# EAGLE design motorsturing (EAGLE 9.6.2)
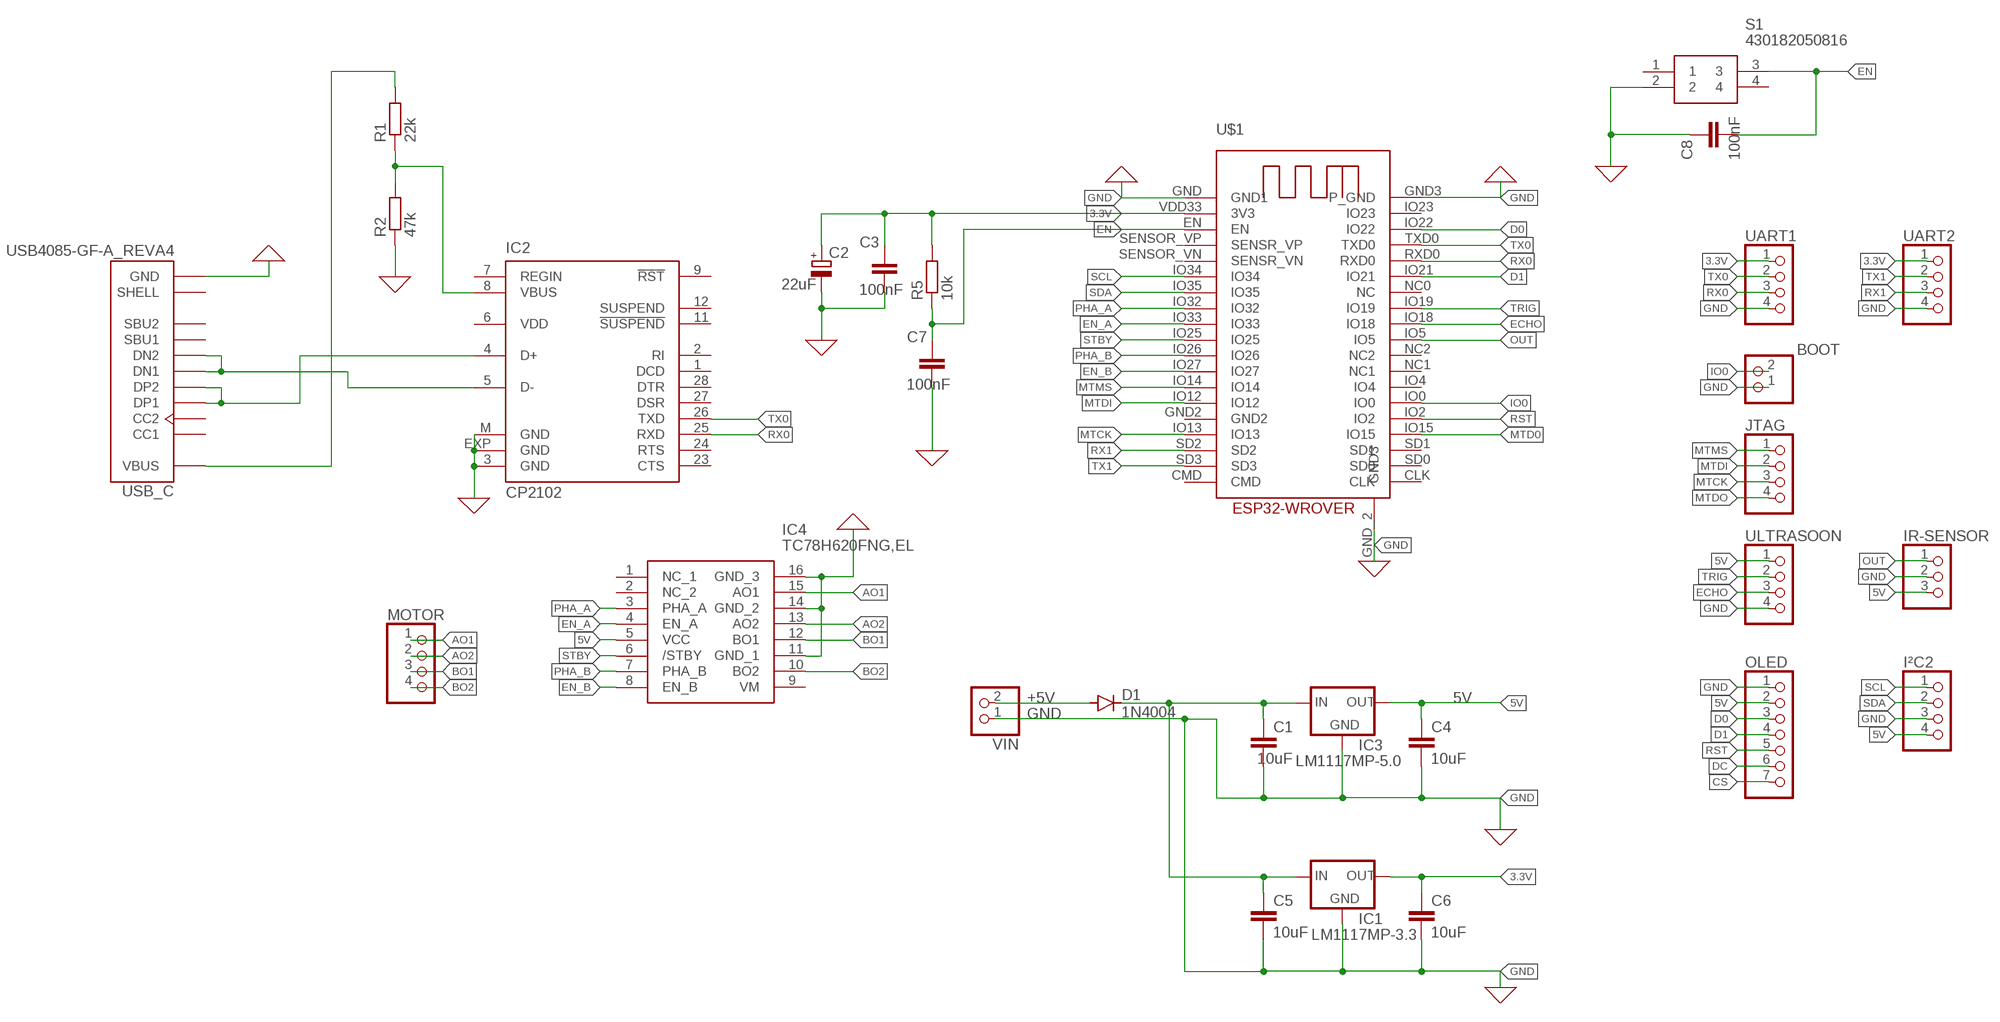
[diagram p0: schematic, sheet 1]

## Parts
BOOT  PINHD-1X2  [1X02]
C1  10uF  C-EUC0603  [C0603]
C2  22uF  CPOL-EUE5-4  [E5-4]
C3  100nF  C-EUC0805  [C0805]
C4  10uF  C-EUC0603  [C0603]
C5  10uF  C-EUC0603  [C0603]
C6  10uF  C-EUC0603  [C0603]
C7  100nF  C-EUC0805  [C0805]
C8  100nF  C-EUC0805  [C0805]
D1  1N4004  [DO41-10]
IC1  LM1117MP-3.3  [SOT223]
IC2  CP2102  [MLP28]
IC3  LM1117MP-5.0  [SOT223]
IC4  TC78H620FNG,EL  [SOP65P640X160-16N]
IR-SENSOR  PINHD-1X3  [1X03]
I²C2  PINHD-1X4  [1X04]
JTAG  PINHD-1X4  [1X04]
MOTOR  PINHD-1X4  [1X04]
OLED  PINHD-1X7  [1X07]
R1  22k  R-EU_M0805  [M0805]
R2  47k  R-EU_M0805  [M0805]
R5  10k  R-EU_M0805  [M0805]
S1  430182050816  [430182070816]
U$1  ESP32-WROVER  [ESP32-WROVER]
UART1  PINHD-1X4  [1X04]
UART2  PINHD-1X4  [1X04]
ULTRASOON  PINHD-1X4  [1X04]
USB_C  USB4085-GF-A_REVA4  [GCT_USB4085-GF-A_REVA4]
VIN  PINHD-1X2  [1X02]

## Nets
0: C2.- C3.1 C7.1 C8.2 IC2.3(GND) IC2.EXP(GND) IC2.M(GND) IC4.11(GND_1) IC4.14(GND_2) IC4.16(GND_3) R2.1 S1.2 USB_C.A1(GND) USB_C.A12(GND) USB_C.B1(GND) USB_C.B12(GND) ; supply symbol labelled GND
3.3V: C2.+ C3.2 C6.1 IC1.2(OUT) IC1.4(OUT) R5.2 U$1.VDD33(3V3) UART1.1 UART2.1
5V: C4.1 IC3.2(OUT) IC3.4(OUT) IC4.5(VCC) IR-SENSOR.3 I²C2.4 OLED.2 ULTRASOON.1
+5V: D1.A VIN.2
AO1: IC4.15(AO1) MOTOR.1
AO2: IC4.13(AO2) MOTOR.2
BO1: IC4.12(BO1) MOTOR.3
BO2: IC4.10(BO2) MOTOR.4
CS: OLED.7
D0: OLED.3 U$1.IO22
D1: OLED.4 U$1.IO21
DC: OLED.6
ECHO: U$1.IO18 ULTRASOON.3
EN: C7.2 C8.1 R5.1 S1.3 U$1.EN
EN_A: IC4.4(EN_A) U$1.IO33
EN_B: IC4.8(EN_B) U$1.IO27
GND: BOOT.1 C1.2 C4.2 C5.2 C6.2 IC1.1(GND) IC3.1(GND) IR-SENSOR.2 I²C2.3 OLED.1 U$1.GND3(P_GND) U$1.GND(GND1) U$1.GND_2(GND3) UART1.4 UART2.4 ULTRASOON.4 VIN.1
IO0: BOOT.2 U$1.IO0
MTCK: JTAG.3 U$1.IO13
MTD0: U$1.IO15
MTDI: JTAG.2 U$1.IO12
MTDO: JTAG.4
MTMS: JTAG.1 U$1.IO14
N$1: IC2.5(D-) USB_C.A7(DN1) USB_C.B7(DN2)
N$2: IC2.4(D+) USB_C.A6(DP1) USB_C.B6(DP2)
N$3: R1.2 USB_C.A4(VBUS) USB_C.A9(VBUS) USB_C.B4(VBUS) USB_C.B9(VBUS)
N$4: IC2.8(VBUS) R1.1 R2.2
N$41: C1.1 C5.1 D1.C IC1.3(IN) IC3.3(IN)
OUT: IR-SENSOR.1 U$1.IO5
PHA_A: IC4.3(PHA_A) U$1.IO32
PHA_B: IC4.7(PHA_B) U$1.IO26
RST: OLED.5 U$1.IO2
RX0: IC2.25(RXD) U$1.RXD0 UART1.3
RX1: U$1.SD2 UART2.3
SCL: I²C2.1 U$1.IO34
SDA: I²C2.2 U$1.IO35
STBY: IC4.6(/STBY) U$1.IO25
TRIG: U$1.IO19 ULTRASOON.2
TX0: IC2.26(TXD) U$1.TXD0 UART1.2
TX1: U$1.SD3 UART2.2
Unconnected: IC2.1(DCD) IC2.2(RI) IC2.7(REGIN) IC2.9(!RST) IC2.11(!SUSPEND) IC2.12(SUSPEND) IC2.23(CTS) IC2.24(RTS) IC2.27(DSR) IC2.28(DTR) IC4.1(NC_1) IC4.2(NC_2) IC4.9(VM) S1.1 S1.4 U$1.CLK U$1.CMD U$1.GND2 U$1.IO4 U$1.IO23 U$1.NC0(NC) U$1.NC1 U$1.NC2 U$1.SD0 U$1.SD1 U$1.SENSOR_VN(SENSR_VN) U$1.SENSOR_VP(SENSR_VP) USB_C.A5(CC1) USB_C.A8(SBU1) USB_C.B5(CC2) USB_C.B8(SBU2) USB_C.P1(SHELL) USB_C.P2(SHELL) USB_C.P3(SHELL) USB_C.P4(SHELL)

## Power pins joined to a net without a drawn wire
VDD: IC2.6(VDD)

## Library data of the parts
BOOT VIN = pinhead:PINHD-1X2: PIN HEADER
C1 C3-C8 = rcl:C-EU: CAPACITOR, European symbol; SPICEPREFIX: C
C2 = rcl:CPOL-EU: POLARIZED CAPACITOR, European symbol; SPICEPREFIX: C
D1 = diode:1N4004: DIODE general purpose rectifier, 1 A
IC1 = lm1117_11:LM1117?-*: 800mA Low-Dropout Linear Regulator Source: http://www.ti.com/lit/ds/symlink/lm1117-n.pdf; MF: Texas Instruments; MPN: LM1117MP-3.3; OC_FARNELL: 9778195; OC_NEWARK: 28X3416
IC2 = silabs:CP210*: Single-Chip USB to UART Bridge Source: www.silabs.com .. CP2101.pdf / cp2102.pdf; MF: FARNELL; MPN: CP2102-GM; OC_FARNELL: 9282130; OC_NEWARK: 30K5635
IC3 = lm1117_11:LM1117?-*: 800mA Low-Dropout Linear Regulator Source: http://www.ti.com/lit/ds/symlink/lm1117-n.pdf; MF: Texas Instruments; MPN: LM1117MP-5.0; OC_FARNELL: 9778209; OC_NEWARK: 28X3417
IC4 = TC78H621FNG:TC78H620FNG,EL: Motor / Motion / Ignition Controllers & Drivers Brush Motor Driver IC 18V 1A Source: Datasheet <https://www.mouser.com/datasheet/2/408/TC78H620FNG_datasheet_en_20161125-1138306.pdf>; ARROW_PART_NUMBER: TC78H620FNG,EL; ARROW_PRICE-STOCK: https://www.arrow.com/en/products/tc78h620fngel/toshiba?region=nac; DESCRIPTION: Motor / Motion / Ignition Controllers & Drivers Brush Motor Driver IC 18V 1A; HEIGHT: 1.6mm; MANUFACTURER_NAME: Toshiba; MANUFACTURER_PART_NUMBER: TC78H620FNG,EL; MOUSER_PART_NUMBER: 757-TC78H620FNGEL; MOUSER_PRICE-STOCK: https://www.mouser.co.uk/ProductDetail/Toshiba/TC78H620FNGEL?qs=gt1LBUVyoHkIiKQSc8wkDw%3D%3D
IR-SENSOR = pinhead:PINHD-1X3: PIN HEADER
I²C2 JTAG MOTOR UART1 UART2 ULTRASOON = pinhead:PINHD-1X4: PIN HEADER
OLED = pinhead:PINHD-1X7: PIN HEADER
R1 R2 R5 = rcl:R-EU_: RESISTOR, European symbol; SPICEPREFIX: R
S1 = push button:430182050816: Black Tactile Tactile Switch, NO 50 mA 1.6mm Surface Mount Source: Datasheet <http://katalog.we-online.de/em/datasheet/4301x2xxx8x6.pdf>; DESCRIPTION: Black Tactile Tactile Switch, NO 50 mA 1.6mm Surface Mount; HEIGHT: mm; MANUFACTURER_NAME: Wurth Elektronik; MANUFACTURER_PART_NUMBER: 430182050816; MOUSER_PART_NUMBER: 710-430182050816; MOUSER_PRICE-STOCK: https://www.mouser.co.uk/ProductDetail/Wurth-Elektronik/430182050816?qs=wr8lucFkNMUyle0jQPgWGw%3D%3D
U$1 = 32teeth - ESP32-WROVER:ESP32-WROVER
USB_C = USB4085-GF-A:USB4085-GF-A_REVA4: USB 2.0 Type C Receptacle Dip Type, PCB Top Mount Check availability <https://pricing.snapeda.com/parts/USB4085-GF-A/Global%20Connector%20Technology/view-part?ref=eda>; AVAILABILITY: In Stock; DESCRIPTION: USB-C (USB TYPE-C) USB 2.0 Receptacle Connector 24 (16+8 Dummy) Position Through Hole, Right Angle, low cost, 3.46mm profile, 16 pin, horizontal, Top mount; MF: Global Connector Technology; MP: USB4085-GF-A; PACKAGE: None; PRICE: None; PURCHASE-URL: https://pricing.snapeda.com/search/part/USB4085-GF-A/?ref=eda

## Board
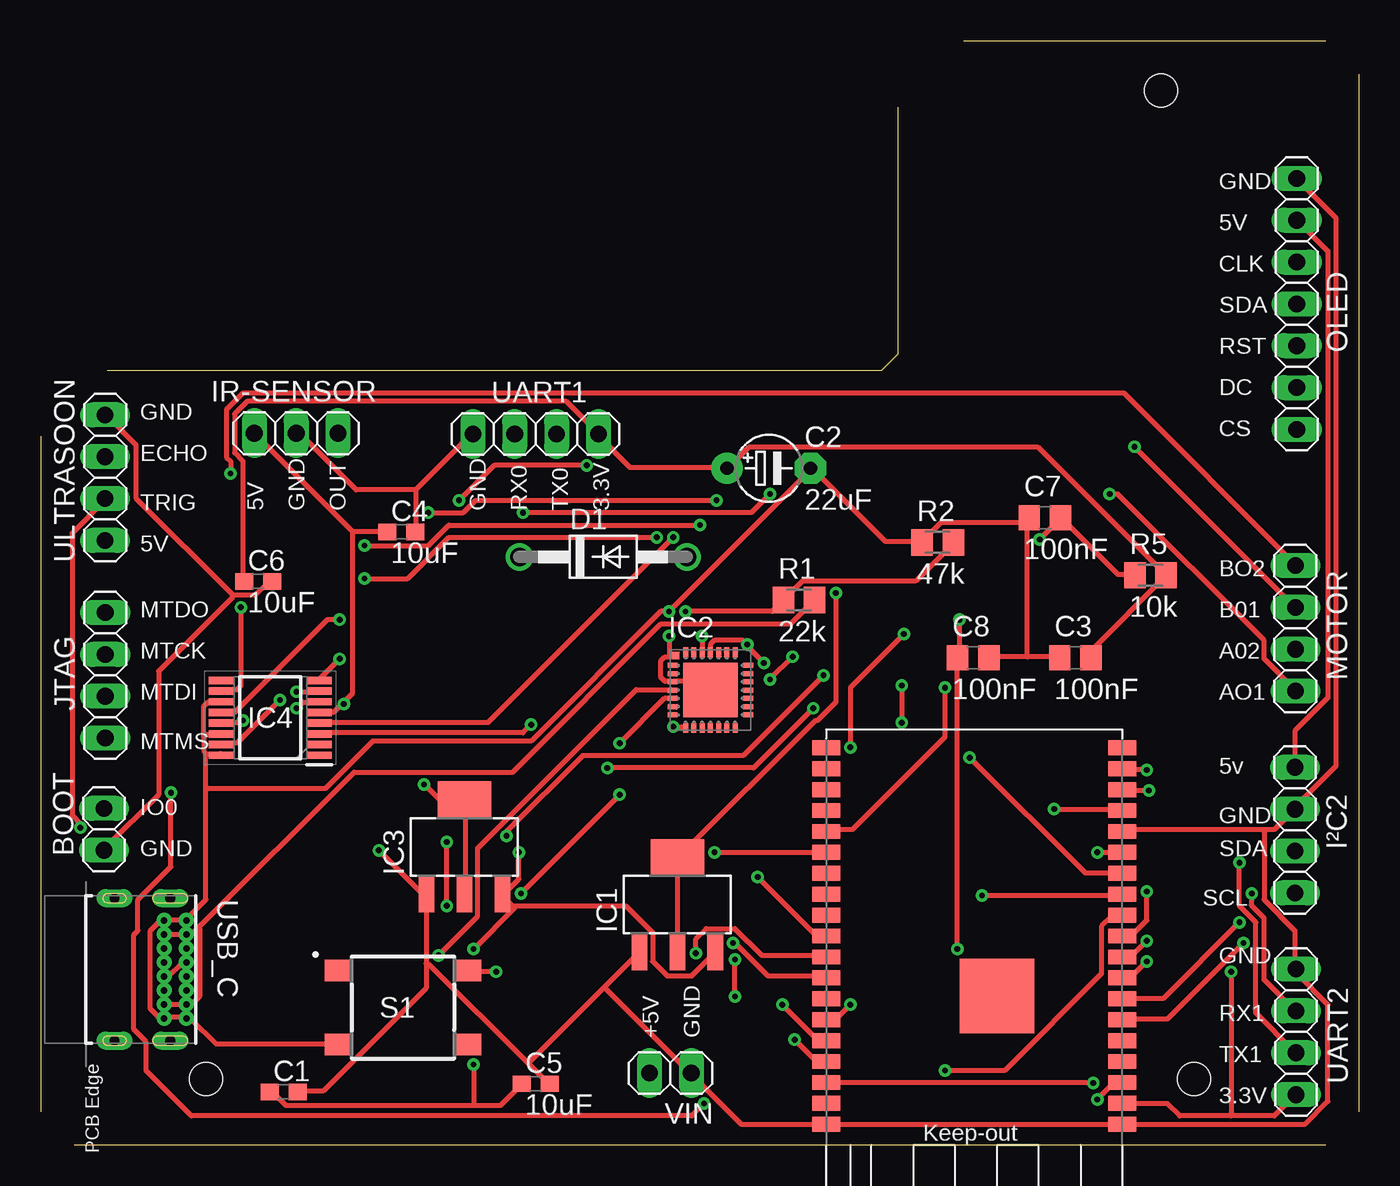
[diagram p1: board, top side]
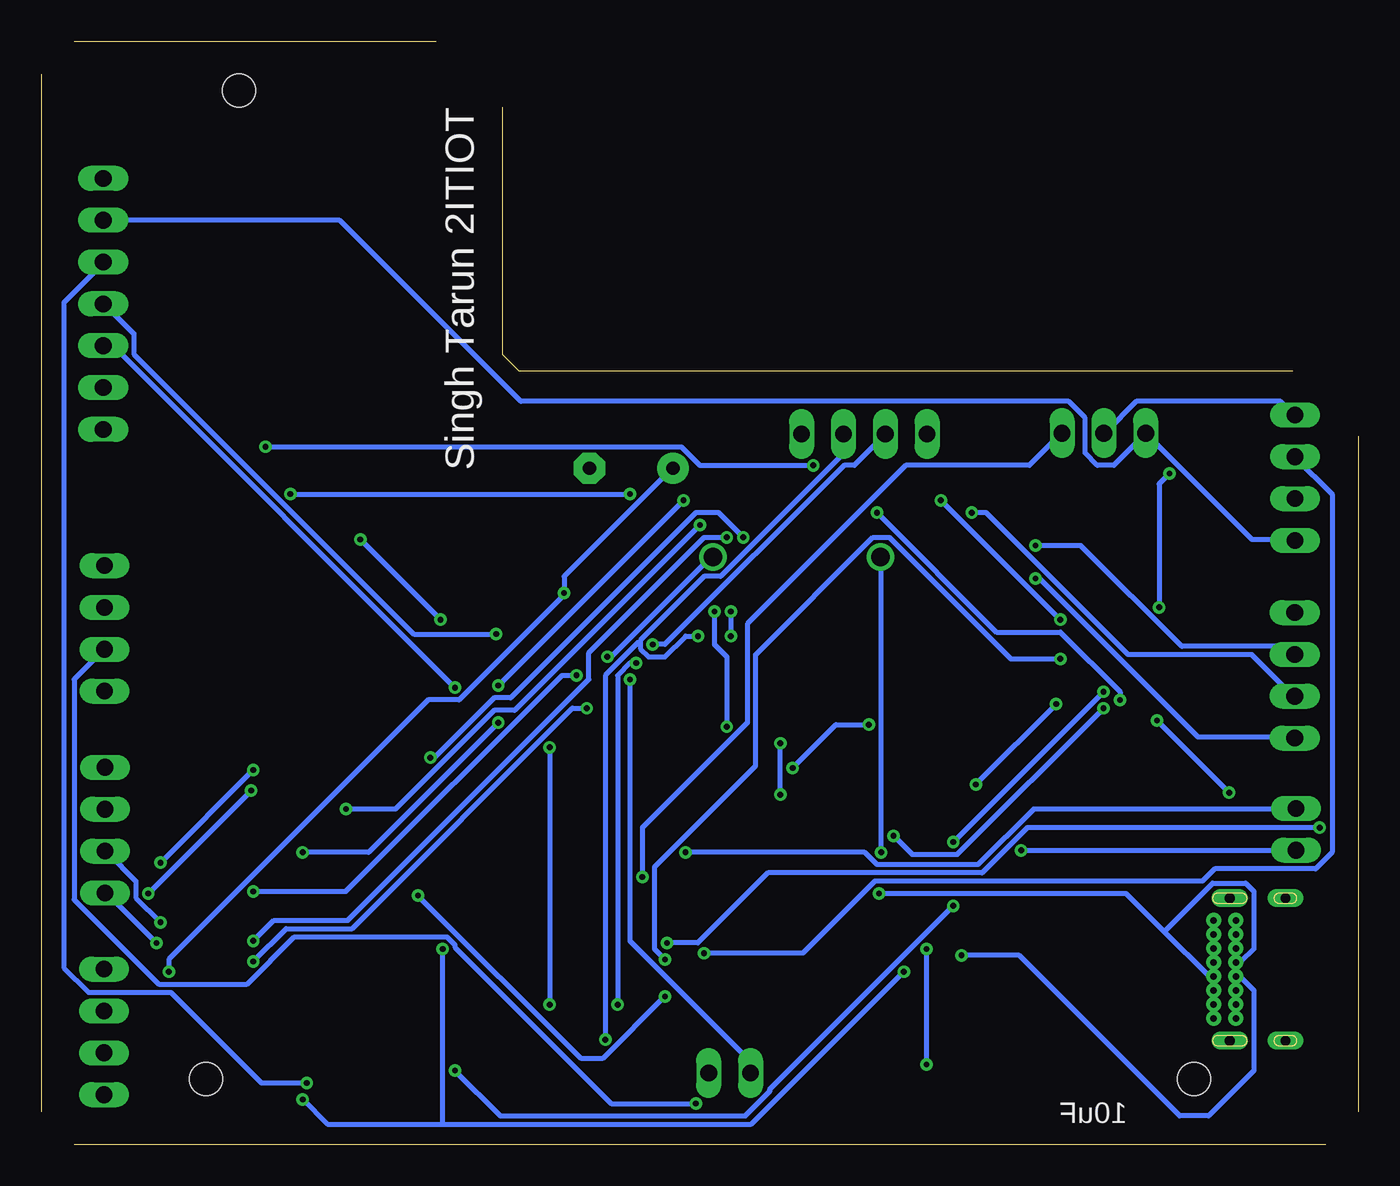
[diagram p2: board, bottom side, seen from below]

Size 80 x 67 mm. Coordinates in mm from the lower left corner, seen from the top.
Outline: 2,0 78,0
Outline: 80,65 80,2
Outline: 52,63 52,48 51,47 4,47
Outline: 78,67 56,67
Outline: 0,2 0,43
Copper layers (1*16): Top 0.035mm / dielectric 1.5mm / Bottom 0.035mm
Design rules "default *": minimum track width 12mil, minimum drill 0.35mm, track to track 6mil, track to pad 6mil, pad to pad 6mil, via to via 6mil, smd to smd 6mil, copper to edge 40mil, drill to drill 6mil, minimum pad ring 10mil, minimum via ring 8mil, stop-mask expansion 4mil, vias tented up to drill 0mil, thermal gap 10mil
Holes 2 mm at 10,4 70,4 68,64

### Footprints (pad centres in the part's own frame; a part is rotated, then mirrored left to right if it is on the bottom)
1X02 = drill 1.016 long: 1 -1.27,0; 2 1.27,0
C0603 = smd 1.1 x 1: 1 -0.85,0; 2 0.85,0
E5-4 = drill 0.813 pad 1.905: + -2.54,0 | drill 0.813 pad 1.905 octagon: - 2.54,0
C0805 = smd 1.3 x 1.5: 1 -0.95,0; 2 0.95,0
DO41-10 = drill 1.118: A 5.08,0; C -5.08,0
SOT223 = smd 0.95 x 2.15: 1 -2.3,-2.9; 2 0,-2.9; 3 2.3,-2.9 | smd 3.25 x 2.15: 4 0,2.9
MLP28 = smd 0.6 x 0.3: 1 -2.3,1.5; 2 -2.3,1; 3 -2.3,0.5; 4 -2.3,0; 5 -2.3,-0.5; 6 -2.3,-1; 7 -2.3,-1.5; 15 2.3,-1.5; 16 2.3,-1; 17 2.3,-0.5; 18 2.3,0; 19 2.3,0.5; 20 2.3,1; 21 2.3,1.5 | smd 0.3 x 0.6: 8 -1.5,-2.3; 9 -1,-2.3; 10 -0.5,-2.3; 11 0,-2.3; 12 0.5,-2.3; 13 1,-2.3; 14 1.5,-2.3; 22 1.5,2.3; 23 1,2.3; 24 0.5,2.3; 25 0,2.3; 26 -0.5,2.3; 27 -1,2.3; 28 -1.5,2.3 | smd 3.3 x 3.3: EXP 0,0 | smd 0.435 x 0.435: M -2.103,2.103
SOP65P640X160-16N = smd 1.525 x 0.45: 1 -2.962,2.275; 2 -2.962,1.625; 3 -2.962,0.975; 4 -2.962,0.325; 5 -2.962,-0.325; 6 -2.962,-0.975; 7 -2.962,-1.625; 8 -2.962,-2.275; 9 2.962,-2.275; 10 2.962,-1.625; 11 2.962,-0.975; 12 2.962,-0.325; 13 2.962,0.325; 14 2.962,0.975; 15 2.962,1.625; 16 2.962,2.275
1X03 = drill 1.016 long: 1 -2.54,0; 2 0,0; 3 2.54,0
1X04 = drill 1.016 long: 1 -3.81,0; 2 -1.27,0; 3 1.27,0; 4 3.81,0
1X07 = drill 1.016 long: 1 -7.62,0; 2 -5.08,0; 3 -2.54,0; 4 0,0; 5 2.54,0; 6 5.08,0; 7 7.62,0
M0805 = smd 1.3 x 1.6: 1 -0.95,0; 2 0.95,0
430182070816 = smd 1.55 x 1.3: 1 -3.975,2.25; 2 -3.975,-2.25; 3 3.975,2.25; 4 3.975,-2.25
ESP32-WROVER = smd 1.7 x 0.9: CLK 18,1.27; CMD 0,1.27; EN 0,21.59; GND 0,24.13; GND3 18,24.13; GND_2 0,6.35; IO0 18,7.62; IO2 18,6.35; IO4 18,8.89; IO5 18,12.7; IO12 0,7.62; IO13 0,5.08; IO14 0,8.89; IO15 18,5.08; IO18 18,13.97; IO19 18,15.24; IO21 18,17.78; IO22 18,21.59; IO23 18,22.86; IO25 0,12.7; IO26 0,11.43; IO27 0,10.16; IO32 0,15.24; IO33 0,13.97; IO34 0,17.78; IO35 0,16.51; NC0 18,16.51; NC1 18,10.16; NC2 18,11.43; RXD0 18,19.05; SD0 18,2.54; SD1 18,3.81; SD2 0,3.81; SD3 0,2.54; SENSOR_VN 0,19.05; SENSOR_VP 0,20.32; TXD0 18,20.32; VDD33 0,22.86 | smd 4.5 x 4.5: GND2 7.62,16.34
GCT_USB4085-GF-A_REVA4 = drill 0.4 pad 0.65: A1 -2.975,4.025; A4 -2.125,4.025; A5 -1.275,4.025; A6 -0.425,4.025; A7 0.425,4.025; A8 1.275,4.025; A9 2.125,4.025; A12 2.975,4.025; B1 2.975,2.675; B4 2.125,2.675; B5 1.275,2.675; B6 0.425,2.675; B7 -0.425,2.675; B8 -1.275,2.675; B9 -2.125,2.675; B12 -2.975,2.675 | drill 0.6 pad 1.108 long: P1 -4.325,3.045; P2 4.325,3.045; P3 4.325,-0.335; P4 -4.325,-0.335

### Placement (x,y rotation side)
BOOT  3.81,19.15 90 top
C1  14.72,3.2 0 top
C2  44.18,41.07 0 top
C3  62.79,29.57 0 top
C4  21.87,37.2 0 top
C5  30.02,3.7 0 top
C6  13.17,34.2 0 top
C7  60.94,38.07 0 top
C8  56.59,29.57 0 top
D1  34.12,35.69 0 top
IC1  38.63,14.58 0 top
IC2  40.63,27.6 0 top
IC3  25.7,18.08 0 top
IC4  13.91,25.92 180 top
IR-SENSOR  15.48,43.2 180 top
I²C2  76.12,19.1 90 top
JTAG  3.89,28.5 90 top
MOTOR  76.15,31.35 90 top
OLED  76.23,51.05 270 top
R1  46.01,33.07 0 top
R2  54.43,36.57 0 top
R5  67.35,34.57 0 top
S1  21.97,8.33 0 top
U$1  65.65,25.37 180 top
UART1  30.02,43.15 180 top
UART2  76.19,6.85 90 top
ULTRASOON  3.88,40.5 90 top
USB_C  4.79,10.64 270 top
VIN  38.2,4.35 180 top

### Tracks (layer width: path | path; a pad name or v marks a point on that pad's centre or on a via)
0  (via drill 0.35)
  Top 0.305: 10,23.75 10.88,23.75 IC4.16 | 10,23.75 9.88,23.88 9.88,24.75 | 9.88,24.75 10,24.88 10.88,24.88 IC4.14 | 9.88,24.75 9.88,26.62 10.12,26.88 10.88,26.88 IC4.11 | S1.2 17.88,6.12 10.62,6.12 9.12,7.62 8.88,7.62 USB_C.A12 8.75,7.75 7.5,7.75 USB_C.B1 7.38,7.75 7.12,7.75 6.62,8.25 6.62,13 7.25,13.62 7.38,13.62 USB_C.B12 7.5,13.62 8.75,13.62 USB_C.A1 8.88,13.75 10,14.88 10,21.62 | 10,21.62 10,23.75 | 59.88,29.62 61.75,29.62 C3.1 | 59.88,29.62 57.62,29.62 C8.2 | 59.88,29.62 59.88,38 C7.1 59.75,37.75 54.62,37.75 53.5,36.62 R2.1 53.38,36.62 51.25,36.62 46.88,41 C2.- 46.75,41 v38.12,32.38 37.62,32.38 29.75,24.5 20.12,24.5 17.25,21.62 10,21.62 | 38.12,29.62 37.88,29.62 37.62,29.38 37.62,28.38 37.88,28.12 38.25,28.12 IC2.3 38.38,28.12 40.12,28.12 40.62,27.62 IC2.EXP | 38.12,29.62 38.5,29.62 IC2.M | v38.12,30.88 38.12,29.62
  Bottom 0.305: v38.12,32.38 v38.12,30.88
3.3V  (via drill 0.35)
  Top 0.305: 72.25,1.75 74.88,1.75 76.12,3 UART2.1 | 72.25,1.75 69.12,1.75 68.38,2.5 65.75,2.5 U$1.VDD33 | IC1.2 38.62,11.75 38.62,17.38 IC1.4 38.75,17.5 47,25.75 47.12,25.75 48.25,26.88 v48.25,33.5 | C3.2 63.75,29.62 63.75,30 68.25,34.5 R5.2 68.25,34.62 60.5,42.38 43,42.38 41.75,41.12 C2.+ 41.62,41.12 35.75,41.12 33.88,43 UART1.1 33.75,43.25 31.88,45.12 12.5,45.12 11.75,44.38 11.75,42 12.25,41.5 12.25,34.25 C6.1 | v72.25,10.5 72.25,1.75
  Bottom 0.305: C2.+ 41.75,41 48.25,34.5 v48.25,33.5 48.25,33.38 54.62,27 56.5,27 72.25,11.25 v72.25,10.5
5V  (via drill 0.35)
  Top 0.305: I²C2.4 76.12,23 76.12,25.12 78.12,27.12 78.12,54.25 76.25,56.12 OLED.2 | IC3.2 25.75,15.25 25.75,20.88 IC3.4 25.62,21 24.12,21 v23.25,21.88 | 18.88,37.25 21,37.25 C4.1 | 18.88,37.25 13,43.12 IR-SENSOR.3 | 18.31,26.81 18.88,27.38 18.88,37.25 | 18.31,26.81 17.75,26.25 IC4.5 | v18.38,26.75 18.31,26.81
  Bottom 0.305: ULTRASOON.1 4,36.75 6.5,36.75 12.88,43.12 IR-SENSOR.3 13,43.12 14.88,41.25 15.88,41.25 16.62,42 16.62,44.12 17.62,45.12 50.88,45.12 61.88,56.12 76.12,56.12 OLED.2 | v18.38,26.75 v23.25,21.88
+5V  (via drill 0.35)
  Top 0.305: v45.62,29.62 v44.25,28.25
  Bottom 0.305: v44.25,28.25 44.25,12.38 37,5.12 37,4.38 VIN.2 | v45.62,29.62 45.38,29.62 39.25,35.75 D1.A
AO1  (via drill 0.35)
  Top 0.305: v14.5,27 11.88,24.38 11,24.38 IC4.15 | v29.25,38.38 43.12,38.38 v44.25,39.5 | v64.88,39.5 65.38,39.5 74.25,30.62 74.25,29.5 76.12,27.62 MOTOR.1
  Bottom 0.305: v14.5,27 14.5,27.5 18.12,31.12 22,31.12 v29.25,38.38 | v64.88,39.5 v44.25,39.5
AO2  (via drill 0.35)
  Top 0.305: v12.25,25.75 12.12,25.62 11,25.62 IC4.13 | v7.88,21.38 7.88,16.88 5.88,14.88 5.88,13 5.62,12.75 5.62,7 6.38,6.25 6.38,4.5 9.12,1.75 39.5,1.75 v40.25,2.5
  Bottom 0.305: v7.88,21.38 v12.25,25.75 | v40.25,2.5 45.38,2.5 54.88,12 54.88,12.12 55.38,12.62 64.62,12.62 67.5,9.75 72.88,9.75 78,14.88 78,28.25 76.25,30 MOTOR.2
BO1  (via drill 0.35)
  Top 0.305: v18.12,31.88 17.38,31.88 11.75,26.25 11,26.25 IC4.12 | v25.38,39.12 27.5,41.25 v33.12,41.25 | v66.38,42.38 76.12,32.62 MOTOR.3
  Bottom 0.305: v25.38,39.12 v18.12,31.88 | v33.12,41.25 40,41.25 41.12,42.38 v66.38,42.38
BO2  (via drill 0.35)
  Top 0.305: v12.12,32.62 12.12,27.88 11.88,27.62 11,27.62 IC4.10 | v11.5,40.75 11.5,41.5 11.25,41.75 11.25,44.62 12.25,45.62 65.75,45.62 76.12,35.25 MOTOR.4
  Bottom 0.305: v12.12,32.62 12.12,40.12 v11.5,40.75
D0  (via drill 0.35)
  Top 0.305: v63.88,3.75 47.75,3.75 U$1.IO22
  Bottom 0.305: v63.88,3.75 66.62,3.75 72.12,9.25 77.12,9.25 78.62,10.75 78.62,51.12 76.25,53.5 OLED.3
D1  (via drill 0.35)
  Top 0.305: v49.12,8.5 48.25,7.62 47.75,7.62 U$1.IO21 | v49.12,24.12 49.12,27.75 v52.38,31
  Bottom 0.305: v49.12,24.12 v49.12,8.5 | v52.38,31 57.38,31 74.38,48 74.38,49.25 76.12,51 OLED.4
ECHO  (via drill 0.35)
  Top 0.305: v39.75,11.62 39.75,12.5 40.38,13.12 42.12,13.12 43.75,11.5 47.62,11.5 U$1.IO18
  Bottom 0.305: v39.75,11.62 33.75,11.62 29.38,16 9.5,16 8.75,16.75 2.62,16.75 1.62,17.75 1.62,39.5 3.88,41.75 ULTRASOON.3
EN  (via drill 0.35)
  Top 0.305: v55.75,31.88 55.75,29.62 C8.1 55.62,29.5 v55.62,11.88 | v60.62,36.75 61.88,38 C7.2 62,38 65.38,34.62 66.38,34.62 R5.1 | v27.62,10.5 26,10.5 S1.3 | v64.12,2.75 65.12,3.75 65.62,3.75 U$1.EN
  Bottom 0.305: v60.62,36.75 v55.75,31.88 | v27.62,10.5 36.88,1.25 55.62,1.25 | 55.62,1.25 62.62,1.25 v64.12,2.75 | 55.62,1.25 v55.62,11.88
EN_A  (via drill 0.35)
  Top 0.305: v38.38,36.88 27.12,25.62 16.88,25.62 IC4.4 | v67.12,12.38 66.25,11.5 65.75,11.5 U$1.IO33
  Bottom 0.305: v38.38,36.88 39.75,36.88 46.75,29.88 46.75,28.25 61.38,13.62 65.88,13.62 v67.12,12.38
EN_B  (via drill 0.35)
  Top 0.305: v18.12,29.5 16.88,28.25 IC4.8 | v42.12,9 v42.12,11.25 | v57.12,15.12 65.62,15.12 U$1.IO27
  Bottom 0.305: v18.12,29.5 21.12,29.5 28.5,36.88 29.5,36.88 36.62,29.75 36.62,23 42.75,16.88 42.75,11.88 v42.12,11.25 | v42.12,9 45.88,5.25 47.25,5.25 v57.12,15.12
GND  (via drill 0.35)
  Top 0.305: 74.25,19.12 74.88,19.12 I²C2.3 76.12,20.5 78.62,23 78.62,56.25 76.25,58.62 OLED.1 | 74.25,19.12 65.75,19.12 U$1.GND_2 | 74.25,19.12 74.25,14.88 76.12,13 76.12,10.75 UART2.4 76.25,10.62 76.25,10.38 78.12,8.5 78.12,2.62 76.75,1.25 65.75,1.25 U$1.GND 65.62,1.25 47.75,1.25 U$1.GND3 47.62,1.25 42.5,1.25 39.5,4.25 VIN.1 39.38,4.38 34.19,9.56 | 22.75,39.75 22.75,37.25 C4.2 | 22.75,39.75 26.12,43.12 UART1.4 | 22.75,39.75 19.12,39.75 15.75,43.12 15.5,43.12 IR-SENSOR.2 | 11.62,33.38 13,33.38 13.75,34.12 14,34.12 C6.2 | 11.62,33.38 5.75,39.25 5.75,42.5 4,44.25 ULTRASOON.4 | BOOT.1 3.88,18 7.12,21.25 7.12,28.75 11.62,33.25 11.62,33.38 | 23.38,11 23.38,15.12 IC3.1 23.25,15.12 v20.5,17.88 | 23.38,11 23.38,9.5 17.12,3.25 15.62,3.25 C1.2 | 29.56,4.94 23.5,11 23.38,11 | 29.56,4.94 30.75,3.75 C5.2 | 29.56,4.94 34.19,9.56 | 34.19,9.56 36.25,11.62 IC1.1
  Bottom 0.305: IR-SENSOR.2 15.38,43.25 13.5,45.12 4.75,45.12 4,44.38 ULTRASOON.4 | v20.5,17.88 3.88,17.88 BOOT.1
IO0  (via drill 0.35)
  Top 0.305: v40.88,17.75 U$1.IO0
  Bottom 0.305: v40.88,17.75 30,17.75 29.25,17 23.12,17 19.75,20.38 3.88,20.38 BOOT.2
MTCK  (via drill 0.35)
  Top 0.305: v61.5,20.38 65.62,20.38 U$1.IO13 | v40,37.62 24.75,37.62 23.5,36.38 v19.62,36.38
  Bottom 0.305: v61.5,20.38 58.5,20.38 52.5,26.38 51.25,26.38 v40,37.62 | v19.62,36.38 16.88,36.38 10.75,30.25 4.38,30.25 4,29.88 JTAG.3
MTDI  (via drill 0.35)
  Top 0.305: v64.12,17.75 U$1.IO12 | v52.25,27.88 v52.25,25.62 | v41,39.12 26.38,39.12 25.62,38.38 v23.5,38.38
  Bottom 0.305: v64.12,17.75 60.12,17.75 v52.25,25.62 | v41,39.12 v52.25,27.88 | v23.5,38.38 22.62,38.38 14,29.75 6.5,29.75 4,27.25 JTAG.2
MTMS  (via drill 0.35)
  Top 0.305: v56.38,23.5 63.38,16.5 65.62,16.5 U$1.IO14 | v37.38,36.88 24.75,36.88 22.25,34.38 v19.62,34.38
  Bottom 0.305: v56.38,23.5 56.12,23.5 52.5,27.12 51.5,27.12 40.25,38.38 38.88,38.38 v37.38,36.88 | v19.62,34.38 19.38,34.38 9.75,24.75 4,24.75 JTAG.1
N$1  (via drill 0.35)
  Top 0.305: v35.12,24.38 37.88,27.12 38.25,27.12 IC2.5 | v29.12,15.25 v35.12,21.25
  Bottom 0.305: v35.12,21.25 v35.12,24.38 | v29.12,15.25 14.12,15.25 11.81,12.94 | 11.81,12.94 9.12,10.25 8.88,10.25 USB_C.A7 | 11.81,12.94 8.88,15.88 6.88,15.88 6.38,15.38 6.38,11.88 7.12,11.12 7.38,11.12 USB_C.B7
N$2  (via drill 0.35)
  Top 0.305: v24.12,11.5 26.5,13.88 26.5,18 36.12,27.62 38.25,27.62 IC2.4 | USB_C.A6 8.75,11 8.5,11 7.75,10.25 7.5,10.25 USB_C.B6
  Bottom 0.305: v24.12,11.5 20.62,11.5 10.88,1.75 9.12,1.75 6.38,4.5 6.38,9.38 7.12,10.12 7.38,10.12 USB_C.B6
N$3
  Top 0.305: USB_C.B4 7.5,8.5 8.75,8.5 USB_C.A9 8.88,8.5 9.12,8.5 9.62,9 9.62,13.12 9.56,13.19 | 9.56,13.19 9.12,12.75 8.88,12.75 USB_C.A4 8.75,12.75 7.5,12.75 USB_C.B9 | 9.56,13.19 19,22.62 28.62,22.62 37.62,31.62 45.5,31.62 46.88,33 R1.2
N$4  (via drill 0.35)
  Top 0.305: v38.38,25.38 39.12,25.38 IC2.8 | v39.12,32.38 44.38,32.38 45,33 R1.1 45.12,33.12 46.25,34.25 53.12,34.25 55.38,36.5 R2.2
  Bottom 0.305: v38.38,25.38 38.38,29.62 39.12,30.38 v39.12,32.38
N$41  (via drill 0.35)
  Top 0.305: 26.25,2.38 27.88,2.38 29.12,3.62 C5.1 | 26.25,2.38 14.88,2.38 14.12,3.12 13.88,3.12 C1.1 | IC1.3 39.5,10.25 38,10.25 37.12,11.12 37.12,12.88 35.5,14.5 28.75,14.5 | 28.75,14.5 28.62,14.5 28,15.12 IC3.3 28.12,15.25 29,16.12 v29,17.75 | v26.25,4.88 26.25,2.38 | v26.25,11.88 28.75,14.38 28.75,14.5
  Bottom 0.305: v29,17.75 29,35.62 D1.C | v26.25,11.88 v26.25,4.88
OUT  (via drill 0.35)
  Top 0.305: v43.5,16.25 47,12.75 47.62,12.75 U$1.IO5
  Bottom 0.305: v43.5,16.25 43.5,19.25 37.12,25.62 37.12,31.62 27.5,41.25 20,41.25 18.12,43.12 IR-SENSOR.1
PHA_A  (via drill 0.35)
  Top 0.305: v29.75,25.5 29.25,25 16.88,25 IC4.3 | v34.38,22.88 43.25,22.88 v46.88,26.5 | v67.12,11.12 66.25,10.25 65.75,10.25 U$1.IO32
  Bottom 0.305: v29.75,25.5 31.75,25.5 v34.38,22.88 | v46.88,26.5 47.75,26.5 61.12,13.12 65.12,13.12 v67.12,11.12
PHA_B  (via drill 0.35)
  Top 0.305: v15.5,27.5 16.75,27.5 IC4.7 | v24.62,14.5 v24.62,18.38 | v54.88,4.5 58.5,4.5 64.38,10.38 64.38,13.25 65,13.88 65.62,13.88 U$1.IO26
  Bottom 0.305: v24.62,18.38 v15.5,27.5 | v24.62,14.5 35.75,3.38 35.75,3.25 37.25,1.75 52.12,1.75 v54.88,4.5
RST  (via drill 0.35)
  Top 0.305: v54.88,27.75 54.88,24.75 49.25,19.12 47.75,19.12 U$1.IO2
  Bottom 0.305: v54.88,27.75 75.62,48.5 76.12,48.5 OLED.5
RX0  (via drill 0.35)
  Top 0.305: IC2.25 40.62,30 40.62,30.38 40.88,30.62 42.62,30.62 v42.88,30.38 42.88,30.25 v43.88,29.25 | v45,8.5 47.12,6.38 47.62,6.38 U$1.RXD0
  Bottom 0.305: v42.88,30.38 42.12,30.38 31.25,41.25 30.62,41.25 28.75,43.12 UART1.3 | v45,8.5 45,28.5 44.25,29.25 v43.88,29.25
RX1  (via drill 0.35)
  Top 0.305: v67.25,21.5 65.75,21.5 U$1.SD2 | v73.5,15.25 73.5,14.5 74.25,13.75 74.25,10 76.12,8.12 UART2.3
  Bottom 0.305: v73.5,15.25 v67.25,21.5
SCL  (via drill 0.35)
  Top 0.305: v73,12.25 68.38,7.62 65.75,7.62 U$1.IO34
  Bottom 0.305: v73,12.25 76,15.25 I²C2.1
SDA  (via drill 0.35)
  Top 0.305: v72.75,13.5 68.12,8.88 65.75,8.88 U$1.IO35
  Bottom 0.305: v72.75,13.5 74.25,15 74.25,16 76,17.75 I²C2.2
STBY  (via drill 0.35)
  Top 0.305: v15.5,26.5 15.88,26.88 16.75,26.88 IC4.6 | v28.25,18.75 28.25,19 32.88,23.62 42.62,23.62 v47.5,28.5 | v67.12,15.38 67.12,13.62 66.25,12.75 65.75,12.75 U$1.IO25
  Bottom 0.305: v15.5,26.5 24.38,17.62 27.12,17.62 v28.25,18.75 | v47.5,28.5 48.38,28.5 61.5,15.38 v67.12,15.38
TRIG  (via drill 0.35)
  Top 0.305: v42,12.25 42.12,12.25 44.12,10.25 47.62,10.25 U$1.IO19 | v2.38,19.25 2.38,19.5 1.88,20 1.88,37.12 3.88,39.12 ULTRASOON.2
  Bottom 0.305: v42,12.25 40.12,12.25 35.88,16.5 22.88,16.5 20.12,19.25 v2.38,19.25
TX0  (via drill 0.35)
  Top 0.305: v40.12,30.88 40.12,30 IC2.26 | v45.75,6.38 47,5.12 47.62,5.12 U$1.TXD0
  Bottom 0.305: v40.12,30.88 40.88,30.88 42.12,29.62 43.12,29.62 43.62,30.12 43.62,30.5 | 43.62,30.5 43.62,30.62 39.75,34.5 38.75,34.5 31.38,41.88 31.38,43.12 UART1.2 | v45.75,6.38 45.75,28.5 43.75,30.5 43.62,30.5
TX1  (via drill 0.35)
  Top 0.305: v67.12,22.75 65.75,22.75 U$1.SD3 | v72.75,17.12 72.75,14.5 73.75,13.5 73.75,8 76.12,5.62 UART2.2
  Bottom 0.305: v72.75,17.12 v67.12,22.75

### Text on the board
tNames: GND | 5V | CLK | SDA | RST | DC | GND | CS | ECHO | TRIG | 5V | GND | OUT | GND | RX0 | TX0 | 3.3V | 5V | BO2 | MTDO | B01 | MTCK | A02 | MTDI | AO1 | MTMS | 5v | IO0 | GND | GND | SDA | SCL | GND | RX1 | +5V | GND | TX1 | 3.3V
bNames: Singh Tarun 2ITIOT